# EAGLE design eeZee Crystal (EAGLE 6.4)
DATABASE: ./../PARTSDB.TXT
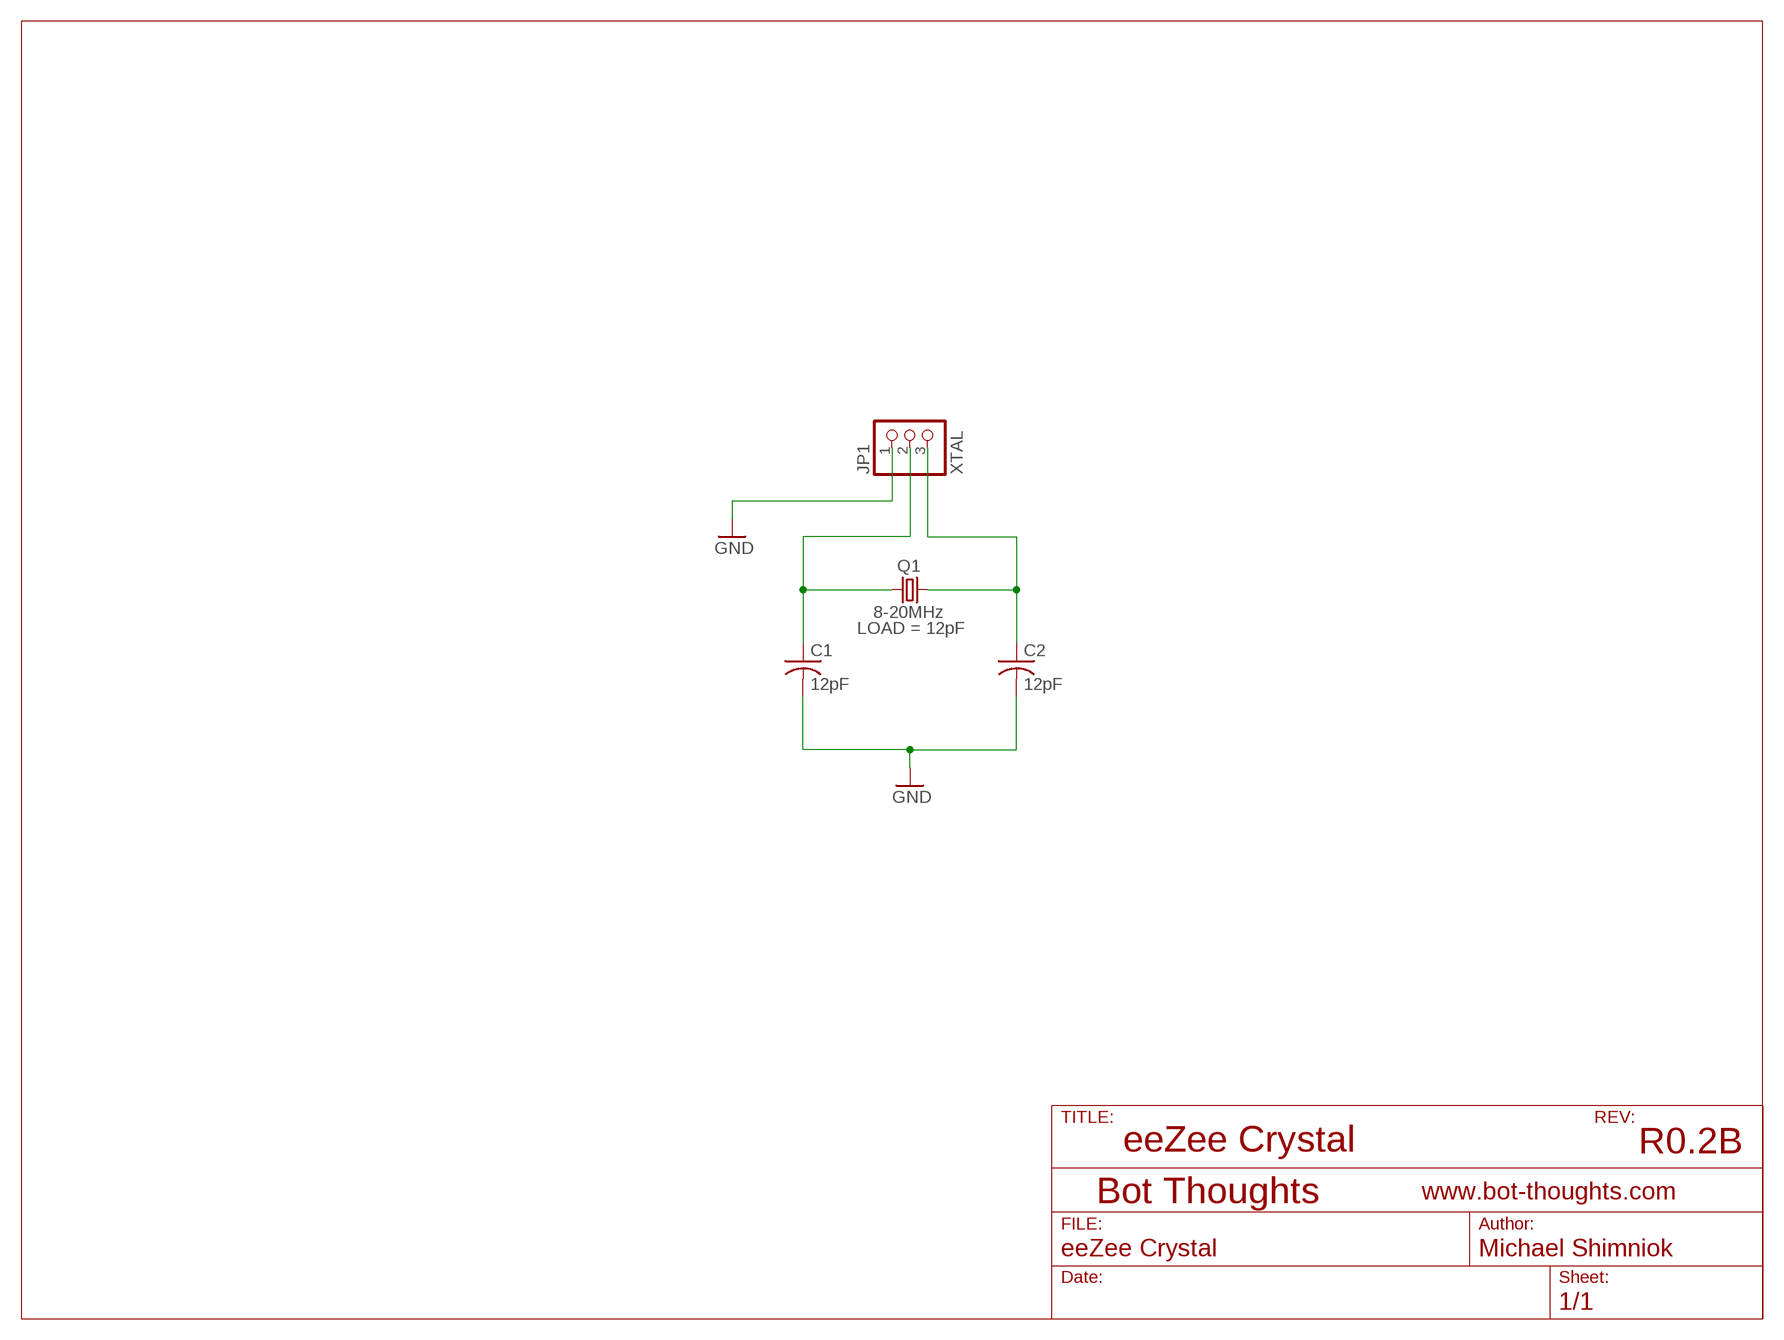
[diagram p0: schematic, sheet 1]

## Parts
C1  12pF  C-USC0603  [C0603]
C2  12pF  C-USC0603  [C0603]
JP1  XTAL  PINHD-1X03_2.54-S  [1X03-S]
Q1  8-20MHz  CRYSTALNDK5X3  [NDK_2PAD_5X3]

## Nets
GND: C1.2 C2.2 JP1.1
N$2: C1.1 JP1.2 Q1.P$2
N$3: C2.1 JP1.3 Q1.P$1

## Notes on the sheet
- eeZee Crystal | R0.2B

## Library data of the parts
C1 C2 = rcl:C-US: CAPACITOR, American symbol; BOM: INCLUDE; PARTNO: C1608C0G1H080D
JP1 = pinhead-2:PINHD-1X03: PIN HEADER; BOM: EXCLUDE
Q1 = mes_crystal:CRYSTAL: CRYSTAL; LOAD: 12pF; PARTNO: NX5032GA-16.000000MHZ-LN-CD-1

## Board
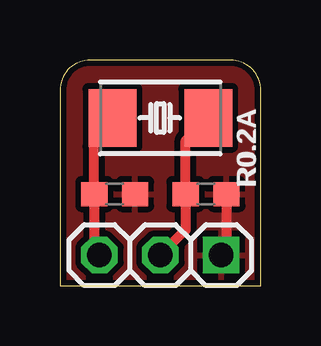
[diagram p1: board, top side]
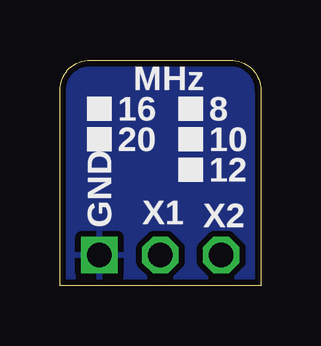
[diagram p2: board, bottom side, seen from below]

Size 8.38 x 9.4 mm. Coordinates in mm from the lower left corner, seen from the top.
Outline: 0,0 8.38,0 8.38,8.13 arc90 7.11,9.4 1.27,9.4 arc90 0,8.13 0,0
Copper layers (1*16): Top 0.0356mm / dielectric 1.5011mm / Bottom 0.0356mm
Design rules "LaenPCBOrder": minimum track width 6mil, minimum drill 13mil, track to track 10mil, track to pad 10mil, pad to pad 10mil, via to via 10mil, smd to smd 8mil, copper to edge 10mil, drill to drill 10mil, minimum pad ring 7mil, minimum via ring 7mil, stop-mask expansion 3mil, vias tented up to drill 20mil, thermal gap 10mil

### Footprints (pad centres in the part's own frame; a part is rotated, then mirrored left to right if it is on the bottom)
C0603 = smd 1.1 x 1: 1 -0.85,0; 2 0.85,0
1X03-S = drill 1.016 square: 1 -2.54,0 | drill 1.016 octagon: 2 0,0; 3 2.54,0
NDK_2PAD_5X3 = smd 2 x 2.4: P$1 -2,0; P$2 2,0

### Placement (x,y rotation side)
C1  6.1,3.81 0 top
C2  2.29,3.81 0 top
JP1  4.19,1.27 180 top
Q1  4.19,6.99 0 top

### Tracks (layer width: path | path; a pad name or v marks a point on that pad's centre or on a via)
GND
  Top 0.406: C1.2 6.95,1.49 JP1.1
  pour Bottom (isolate 0.203): 0,0 0,8.13 arc-90 1.27,9.4 7.11,9.4 arc-90 8.38,8.13 8.38,0
  pour Top: 0,0 0,8.13 arc-90 1.27,9.4 7.11,9.4 arc-90 8.38,8.13 8.38,0
N$2
  Top 0.406: Q1.P$2 5.25,6.04 C1.1 5.25,2.33 JP1.2
N$3
  Top 0.406: Q1.P$1 1.44,6.23 C2.1 1.44,1.49 JP1.3

### Text on the board
bPlace: X1 | X2 | GND
tNames: R0.2A
bNames: MHz | 8 | 16 | 10 | 20 | 12
tsilk: R0.2A
bsilk: MHz | 8 | 16 | 10 | 20 | 12 | X1 | X2 | GND